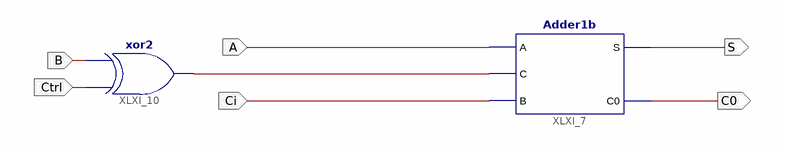
[diagram p0: schematic sheet 1]
// Xilinx ISE schematic AddSub1b.sch (kintex7) as structural Verilog: 2 symbols, 6 ports
module AddSub1b (
  input  A,
  input  Ci,
  input  B,
  input  Ctrl,
  output S,
  output C0
);

  wire XLXN_21;

  Adder1b XLXI_7 (.A(A), .C(XLXN_21), .B(Ci), .S(S), .C0(C0));
  xor XLXI_10 (XLXN_21, Ctrl, B);
endmodule
